# EAGLE design Accessory - Power (EAGLE 5.06)
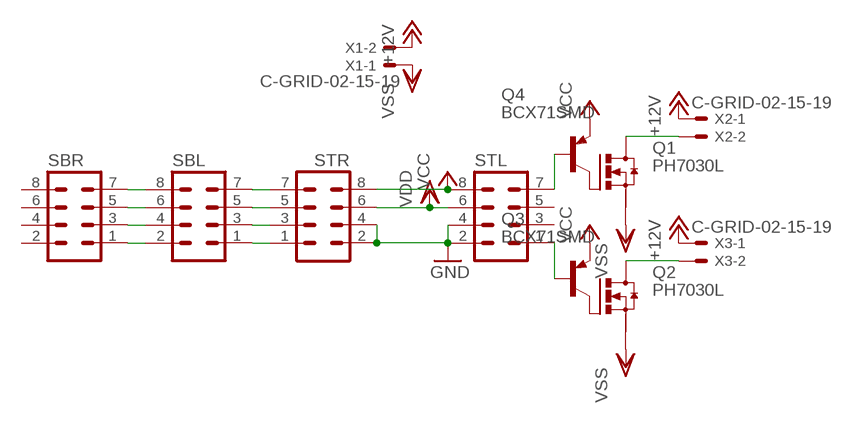
[diagram p0: schematic, sheet 1]

## Parts
Q1  PH7030L  [SOT669]
Q2  PH7030L  [SOT669]
Q3  BCX71SMD  [SOT23]
Q4  BCX71SMD  [SOT23]
SBL  MA04-2  [MA04-2]
SBR  MA04-2  [MA04-2]
STL  MA04-2  [MA04-2]
STR  MA04-2  [MA04-2]
X1  C-GRID-02-15-19  [15-91-02]
X2  C-GRID-02-15-19  [15-91-02]
X3  C-GRID-02-15-19  [15-91-02]

## Nets
+12V: X1.2 X2.1 X3.1
GND: STL.2 STL.4 STR.2 STR.4
N$2: Q1.4(G) Q4.3(C)
N$3: Q2.4(G) Q3.3(C)
N$4: Q4.1(B) STL.7
N$5: Q3.1(B) STL.1
N$6: Q1.MB(D) X2.2
N$7: Q2.MB(D) X3.2
N$8: SBL.7 STR.7
N$9: SBL.5 STR.5
N$10: SBL.3 STR.3
N$11: SBL.1 STR.1
N$12: SBL.2 SBR.1
N$13: SBL.4 SBR.3
N$14: SBL.6 SBR.5
N$15: SBL.8 SBR.7
VCC: Q3.2(E) Q4.2(E) STL.8 STR.8
VDD: STL.6 STR.6
VSS: Q1.1(S) Q2.1(S) X1.1
Unconnected: Q1.2(S) Q1.3(S) Q2.2(S) Q2.3(S) SBR.2 SBR.4 SBR.6 SBR.8 STL.3 STL.5

## Library data of the parts
Q1 Q2 = transistor-power:PH7030L: N-channel TrenchMOS (TM) logic level FET Source: http://www.nxp.com/acrobat_download/datasheets/PH7030L_4.pdf
Q3 Q4 = transistor-pnp:BCX71SMD: PNP Transistor
SBL SBR STL STR = con-lstb:MA04-2: PIN HEADER
X1-X3 = con-molex:C-GRID-02: CONNECTOR wire to board 2.54 mm (0.100") pitch header

## Board
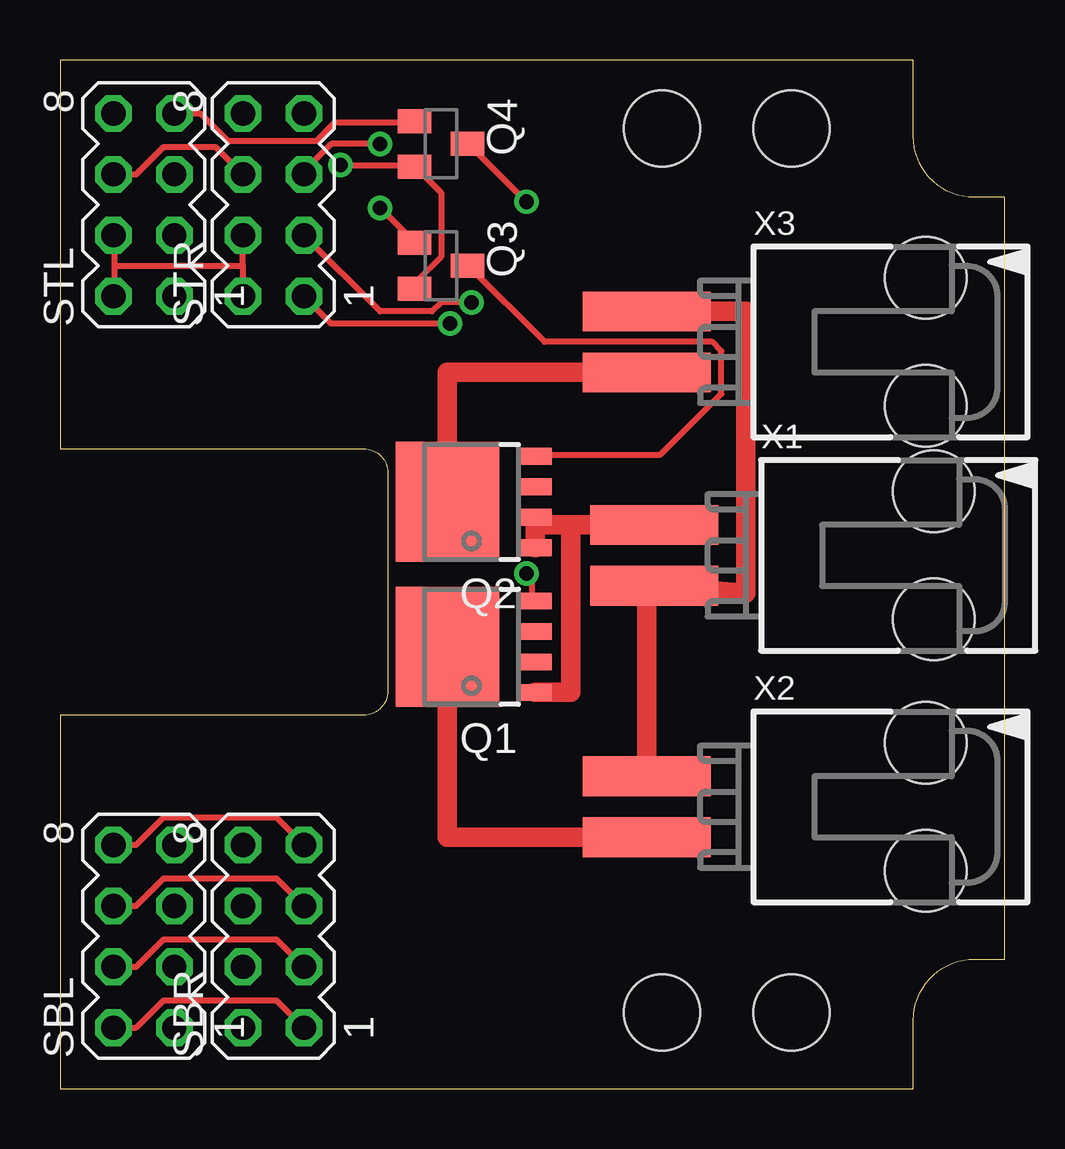
[diagram p1: board, top side]
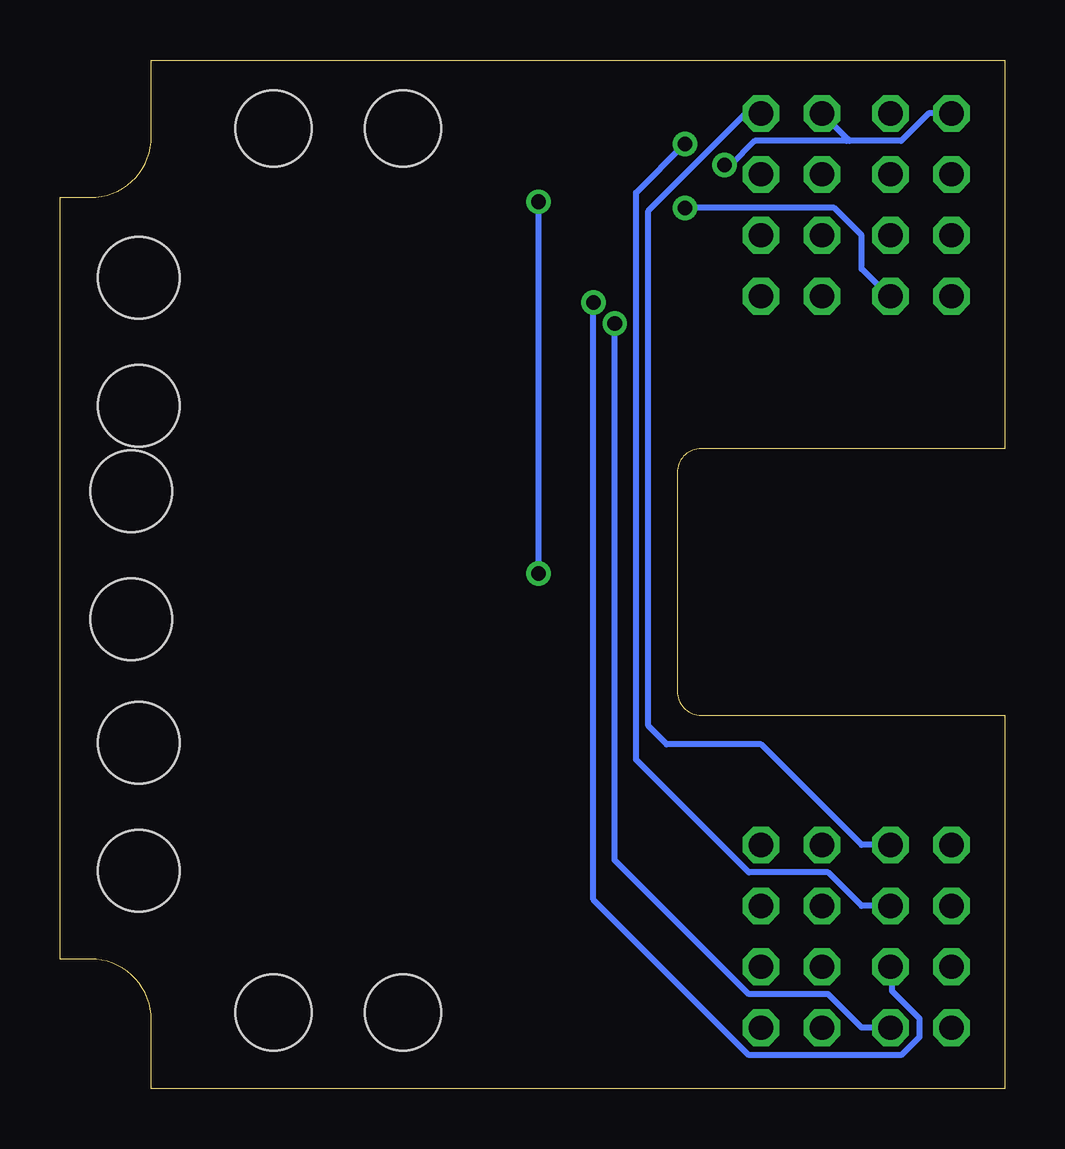
[diagram p2: board, bottom side, seen from below]

Size 39.37 x 42.86 mm. Coordinates in mm from the lower left corner, seen from the top.
Outline: 0,15.56 0,0 35.56,0 35.56,2.86 arc-90 38.1,5.4 39.37,5.4 39.37,37.15 38.11,37.14 arc-91 35.56,39.68 35.56,42.86 0,42.86 0,26.67 12.65,26.67 arc-90 13.65,25.67 13.65,16.56 arc-90 12.65,15.56 0,15.56
Copper layers (1*16): Top 0.035mm / dielectric 1.5mm / Bottom 0.035mm
Design rules "default": minimum track width 10mil, minimum drill 24mil, track to track 8mil, track to pad 8mil, pad to pad 8mil, via to via 8mil, smd to smd 8mil, copper to edge 40mil, drill to drill 8mil, minimum pad ring 10mil, minimum via ring 8mil, stop-mask expansion 4mil, vias tented up to drill 0mil, thermal gap 10mil
Holes 3.17 mm at 30.48,40.01 30.48,3.17 25.08,40.01 25.08,3.17

### Footprints (pad centres in the part's own frame; a part is rotated, then mirrored left to right if it is on the bottom)
SOT669 = smd 0.7 x 1.4: 1 -1.905,-2.65; 2 -0.635,-2.65; 3 0.635,-2.65; 4 1.905,-2.65 | smd 5 x 4.3: MB 0,1
SOT23 = smd 1 x 1.4: 1 -0.95,-1.1; 2 0.95,-1.1; 3 0,1.1
MA04-2 = drill 1.016 octagon: 1 -3.81,-1.27; 2 -3.81,1.27; 3 -1.27,-1.27; 4 -1.27,1.27; 5 1.27,-1.27; 6 1.27,1.27; 7 3.81,-1.27; 8 3.81,1.27
15-91-02 = smd 1.651 x 5.334: 1 -1.27,-10.795; 2 1.27,-10.795 | hole 3.404: -2.667,0.838; 2.667,0.838

### Placement (x,y rotation side)
Q1  17.14,18.41 90 top
Q2  17.14,24.45 90 top
Q3  15.88,34.29 270 top
Q4  15.88,39.37 270 top
SBL  3.49,6.35 90 top
SBR  8.89,6.35 90 top
STL  3.49,36.83 90 top
STR  8.89,36.83 90 top
X1  35.56,22.23 270 top
X2  35.24,11.75 270 top
X3  35.24,31.11 270 top

### Tracks (layer width: path | path; a pad name or v marks a point on that pad's centre or on a via)
+12V
  Top 0.813: X2.1 24.45,20.95 X1.2 28.57,20.64 28.57,32.38 X3.1
GND
  Top 0.254: 2.29,34.29 2.29,35.56 STL.4 | 2.29,34.29 2.29,33.02 STL.2 | 7.62,34.29 STR.4 | 7.62,34.29 STR.2 | 2.29,34.29 7.62,34.29
N$2  (via drill 0.61)
  Top 0.254: v19.43,21.46 19.68,21.21 19.68,20.32 Q1.4 | v19.43,36.96 17.02,39.37 Q4.3
  Bottom 0.254: v19.43,21.46 v19.43,36.96
N$3
  Top 0.254: Q2.4 19.81,26.42 25.02,26.42 27.56,28.96 27.56,30.73 27.18,31.11 20.19,31.11 17.02,34.29 Q3.3
N$4
  Top 0.254: Q4.1 14.73,40.26 11.43,40.26 10.67,39.5 6.99,39.5 5.84,40.64 STL.7
N$5  (via drill 0.61)
  Top 0.254: v13.34,36.7 14.73,35.31 Q3.1
  Bottom 0.254: v13.34,36.7 7.11,36.7 5.97,35.56 5.97,34.16 4.83,33.02 STL.1
N$6
  Top 0.813: X2.2 16.14,10.48 Q1.MB
N$7
  Top 0.813: X3.2 16.14,29.84 Q2.MB
N$8
  Bottom 0.254: STR.7 10.79,40.64 14.86,36.58 14.86,15.11 14.1,14.35 10.16,14.35 5.97,10.16 SBL.7
N$9  (via drill 0.61)
  Top 0.254: v13.34,39.37 11.3,39.37 10.16,38.23 STR.5
  Bottom 0.254: v13.34,39.37 15.37,37.34 15.37,13.72 10.67,9.02 7.37,9.02 5.97,7.62 SBL.5
N$10  (via drill 0.61)
  Top 0.254: v17.14,32.77 15.88,32.77 15.49,32.38 13.34,32.38 STR.3
  Bottom 0.254: v17.14,32.77 17.14,7.87 10.67,1.4 4.32,1.4 3.56,2.16 3.56,2.92 4.7,4.06 4.7,5.08 SBL.3
N$11  (via drill 0.61)
  Top 0.254: v16.26,31.88 11.3,31.88 STR.1
  Bottom 0.254: v16.26,31.88 16.26,9.53 10.67,3.94 7.37,3.94 5.97,2.54 SBL.1
N$12
  Top 0.254: SBR.1 9.02,3.68 4.32,3.68 3.17,2.54 SBL.2
N$13
  Top 0.254: SBR.3 9.02,6.22 4.32,6.22 3.17,5.08 SBL.4
N$14
  Top 0.254: SBR.5 9.02,8.76 4.32,8.76 3.17,7.62 SBL.6
N$15
  Top 0.254: SBR.7 9.02,11.3 4.32,11.3 3.17,10.16 SBL.8
VCC  (via drill 0.61)
  Top 0.254: Q3.2 14.86,33.4 14.86,33.66 15.88,34.67 15.88,37.34 14.86,38.35 Q4.2 14.73,38.48 v11.68,38.48
  Bottom 0.254: 6.54,39.56 STR.8 | 6.54,39.56 6.48,39.5 4.32,39.5 3.17,40.64 STL.8 | v11.68,38.48 11.43,38.48 10.41,39.5 6.6,39.5 6.54,39.56
VDD
  Top 0.254: STR.6 6.48,39.24 4.32,39.24 3.17,38.1 STL.6
VSS
  Top 0.813: 21.27,23.5 X1.1 | 21.27,23.5 21.27,16.51 Q1.1 | 21.27,23.5 19.8,23.5 Q2.1